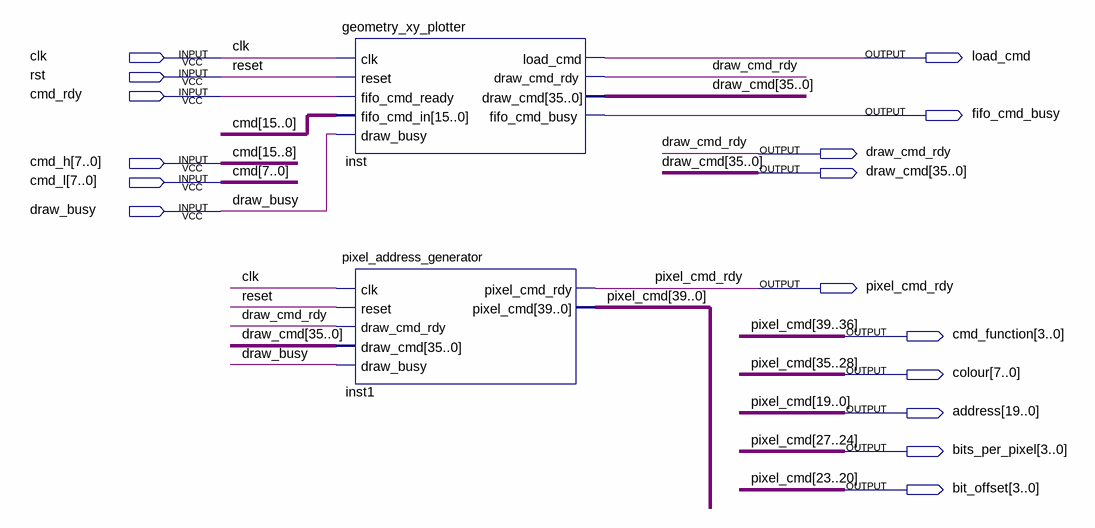
[diagram p0: schematic sheet]
// Quartus schematic geo.bdf as structural Verilog: 2 symbols, 16 pins
module geo (
  input  clk,
  input  rst,
  input  cmd_rdy,
  input  [7:0] cmd_h,
  input  [7:0] cmd_l,
  input  draw_busy,
  output load_cmd,
  output fifo_cmd_busy,
  output draw_cmd_rdy,
  output [35:0] draw_cmd,
  output pixel_cmd_rdy,
  output [3:0] cmd_function,
  output [7:0] colour,
  output [19:0] address,
  output [3:0] bits_per_pixel,
  output [3:0] bit_offset
);

  geometry_xy_plotter inst (
    .clk(clk), .reset(rst), .fifo_cmd_ready(cmd_rdy), .fifo_cmd_in({cmd_h, cmd_l}), .draw_busy(draw_busy),
    .load_cmd(load_cmd), .draw_cmd_rdy(draw_cmd_rdy), .draw_cmd(draw_cmd), .fifo_cmd_busy(fifo_cmd_busy));
  pixel_address_generator inst1 (
    .clk(clk), .reset(rst), .draw_cmd_rdy(draw_cmd_rdy), .draw_cmd(draw_cmd), .draw_busy(draw_busy),
    .pixel_cmd_rdy(pixel_cmd_rdy), .pixel_cmd({cmd_function, colour, bits_per_pixel, bit_offset, address}));

  // Other names for the same wires on the sheet: cmd[15:0] = {cmd_h, cmd_l};
  //   pixel_cmd[39:0] = {cmd_function, colour, bits_per_pixel, bit_offset, address}; reset = rst
endmodule
